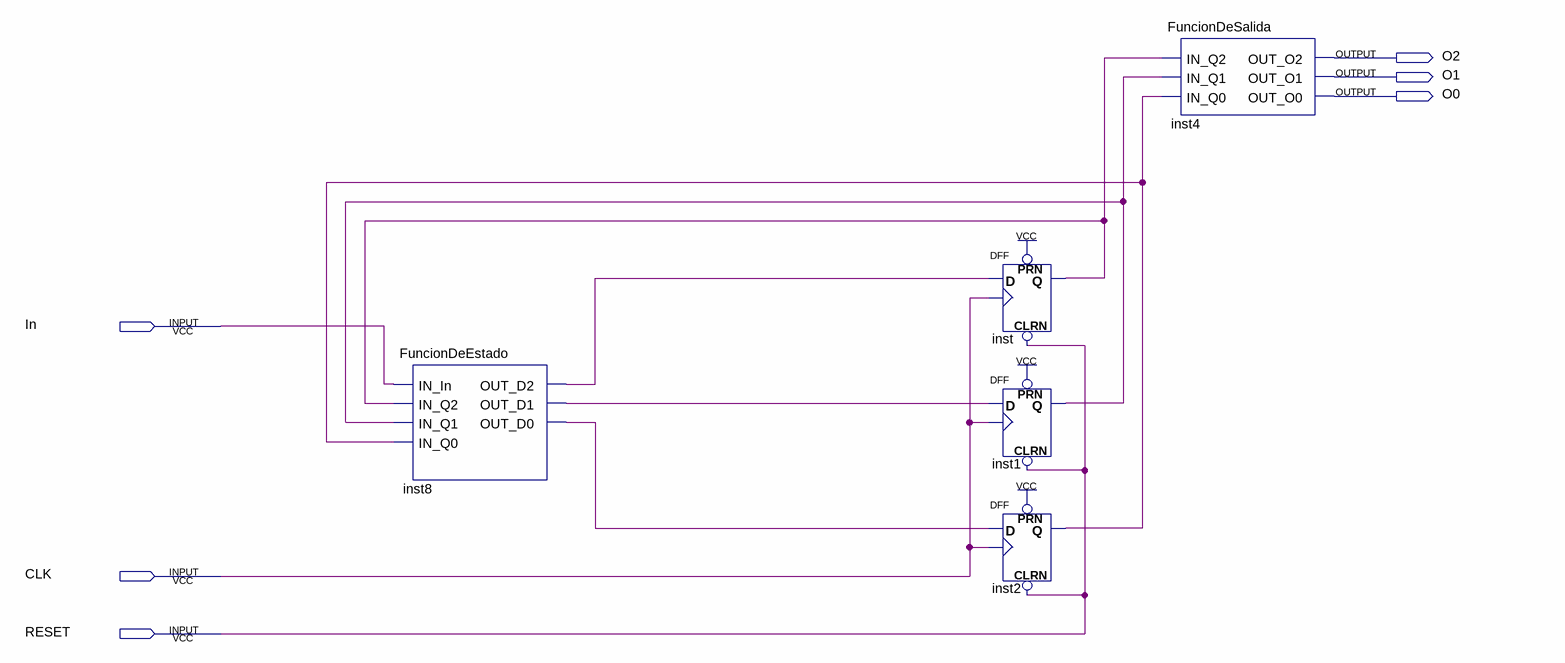
[diagram p0: schematic sheet]
// Quartus schematic MEF.bdf as structural Verilog: 5 symbols, 6 pins
module MEF (
  input  In,
  input  CLK,
  input  RESET,
  output O2,
  output O1,
  output O0
);

  wire inst1_q, inst2_q, inst8_out_d0, inst8_out_d1, inst8_out_d2, inst_q;

  FuncionDeEstado inst8 (
    .IN_In(In), .IN_Q2(inst_q), .IN_Q1(inst1_q), .IN_Q0(inst2_q), .OUT_D2(inst8_out_d2),
    .OUT_D1(inst8_out_d1), .OUT_D0(inst8_out_d0));
  DFF inst (.CLRN(RESET), .CLK(CLK), .D(inst8_out_d2), .PRN(1'b1), .Q(inst_q));
  DFF inst1 (.CLRN(RESET), .CLK(CLK), .D(inst8_out_d1), .PRN(1'b1), .Q(inst1_q));
  DFF inst2 (.CLRN(RESET), .CLK(CLK), .D(inst8_out_d0), .PRN(1'b1), .Q(inst2_q));
  FuncionDeSalida inst4 (.IN_Q2(inst_q), .IN_Q1(inst1_q), .IN_Q0(inst2_q), .OUT_O2(O2), .OUT_O1(O1), .OUT_O0(O0));
endmodule
